# EAGLE design controller (EAGLE 7.2.0)
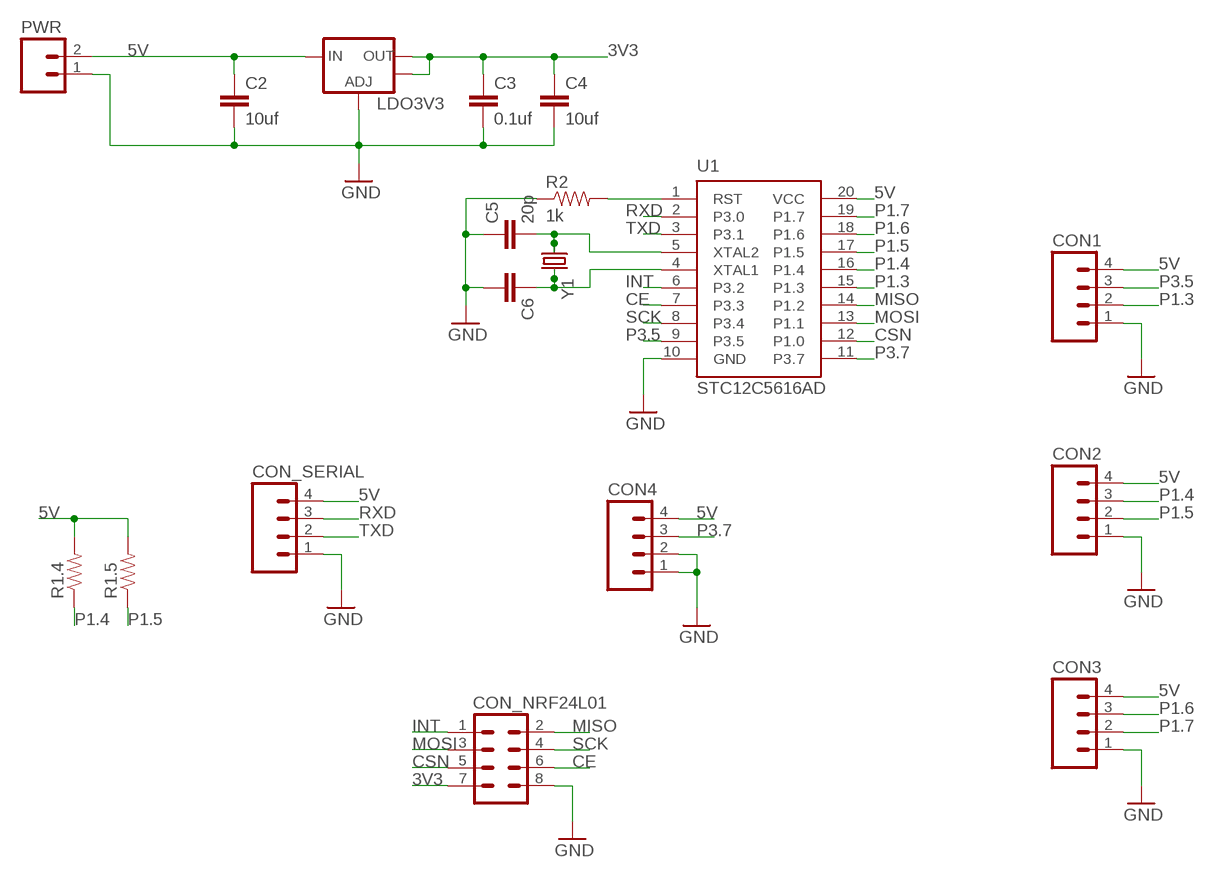
[diagram p0: schematic, sheet 1]

## Parts
C2  10uf  CAP0805  [0805]
C3  0.1uf  CAP0805  [0805]
C4  10uf  CAP0805  [0805]
C5  20p  CAP0603-CAP  [0603-CAP]
C6  CAP0603-CAP  [0603-CAP]
CON1  M04PTH  [1X04]
CON2  M04PTH  [1X04]
CON3  M04PTH  [1X04]
CON4  M04PTH  [1X04]
CON_NRF24L01  M04X2  [2X4]
CON_SERIAL  M04PTH  [1X04]
LDO3V3  V_REG_LM1117SOT223  [SOT223]
PWR  M02PTH  [1X02]
R1.4  RESISTOR0805-RES  [0805]
R1.5  RESISTOR0805-RES  [0805]
R2  1k  RESISTOR0805-RES  [0805]
U1  STC12C5616AD  [SOP20]
Y1  CRYSTALHC49US  [HC49US]

## Nets
3V3: C3.1 C4.1 CON_NRF24L01.7 LDO3V3.2(OUT) LDO3V3.4(OUT)
5V: C2.1 CON1.4 CON2.4 CON3.4 CON4.4 CON_SERIAL.4 LDO3V3.3(IN) PWR.2 R1.4.2 R1.5.2 U1.20(VCC)
CE: CON_NRF24L01.6 U1.7(P3.3)
CSN: CON_NRF24L01.5 U1.12(P1.0)
GND: C2.2 C3.2 C4.2 C5.1 C6.2 CON1.1 CON2.1 CON3.1 CON4.1 CON4.2 CON_NRF24L01.8 CON_SERIAL.1 LDO3V3.1(ADJ) PWR.1 R2.1 U1.10(GND)
INT: CON_NRF24L01.1 U1.6(P3.2)
MISO: CON_NRF24L01.2 U1.14(P1.2)
MOSI: CON_NRF24L01.3 U1.13(P1.1)
N$1: C5.2 U1.5(XTAL2) Y1.1
N$2: C6.1 U1.4(XTAL1) Y1.2
N$3: R2.2 U1.1(RST)
P1.3: CON1.2 U1.15(P1.3)
P1.4: CON2.3 R1.4.1 U1.16(P1.4)
P1.5: CON2.2 R1.5.1 U1.17(P1.5)
P1.6: CON3.3 U1.18(P1.6)
P1.7: CON3.2 U1.19(P1.7)
P3.5: CON1.3 U1.9(P3.5)
P3.7: CON4.3 U1.11(P3.7)
RXD: CON_SERIAL.3 U1.2(P3.0)
SCK: CON_NRF24L01.4 U1.8(P3.4)
TXD: CON_SERIAL.2 U1.3(P3.1)

## Library data of the parts
C2-C6 = SparkFun-Capacitors:CAP: Capacitor Standard 0603 ceramic capacitor, and 0.1" leaded capacitor.
CON1-CON4 CON_SERIAL = SparkFun-Connectors:M04: Header 4 Standard 4-pin 0.1" header. Use with straight break away headers (SKU : PRT-00116), right angle break away headers (PRT-00553), swiss pins (PRT-00743), machine pins (PRT-00117), and female headers (PRT-00115). Molex polarized connector foot print use with SKU : PRT-08231 with associated crimp pins and housings. 1MM SMD Version SKU: PRT-10208
CON_NRF24L01 = SparkFun-Connectors:M04X2: .1" header, two rows of four.
LDO3V3 = SparkFun-PowerIC:V_REG_LM1117: Voltage Regulator LM1117 Standard adjustable voltage regulator but in SMD form. Spark Fun Electronics SKU : COM-00595; PROD_ID: VREG-08170
PWR = SparkFun-Connectors:M02: Standard 2-pin 0.1" header. Use with - straight break away headers ( PRT-00116) - right angle break away headers (PRT-00553) - swiss pins (PRT-00743) - machine pins (PRT-00117) - female headers (PRT-00115) Molex polarized connector foot print use with: PRT-08233 with associated crimp pins and housings. 2.54_SCREWTERM for use with PRT-10571. 3.5mm Screw Terminal footprints for PRT-08084 5mm Screw Terminal footprints for use with PRT-08432
R1.4 R1.5 R2 = SparkFun-Resistors:RESISTOR: Resistor Basic schematic elements and footprints for 0603, 1206, and PTH resistors.
U1 = SparkFun-DigitalIC:STC12C5616AD
Y1 = SparkFun-FreqCtrl:CRYSTAL: Various standard crystals. Proven footprints.

## Board
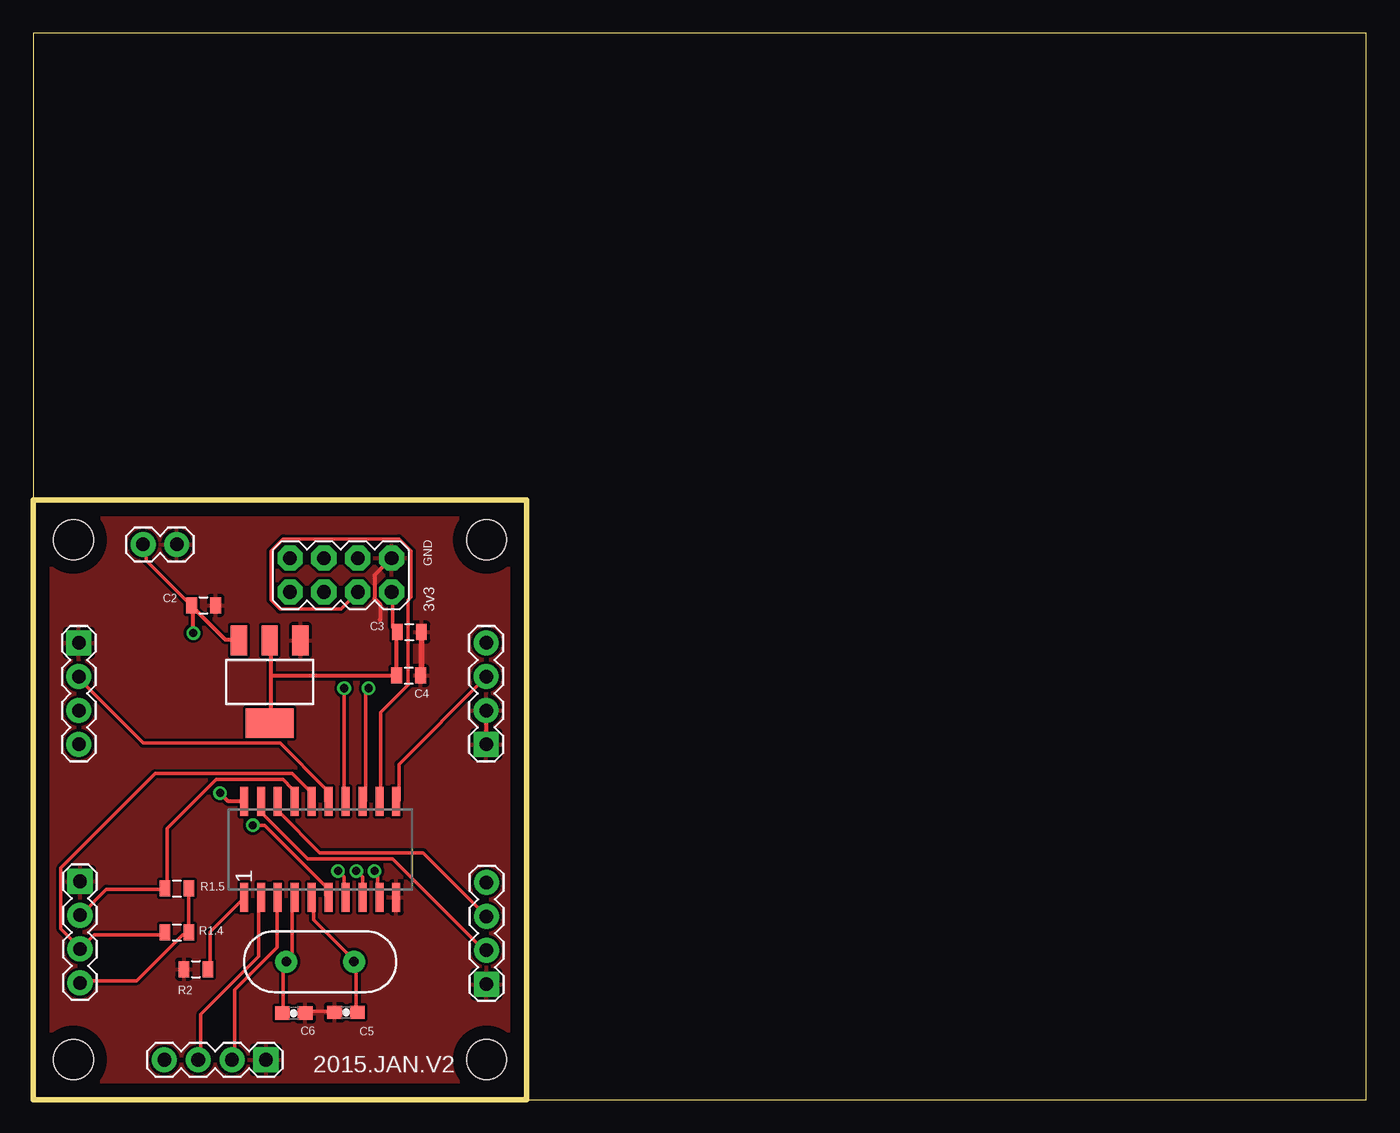
[diagram p1: board, top side]
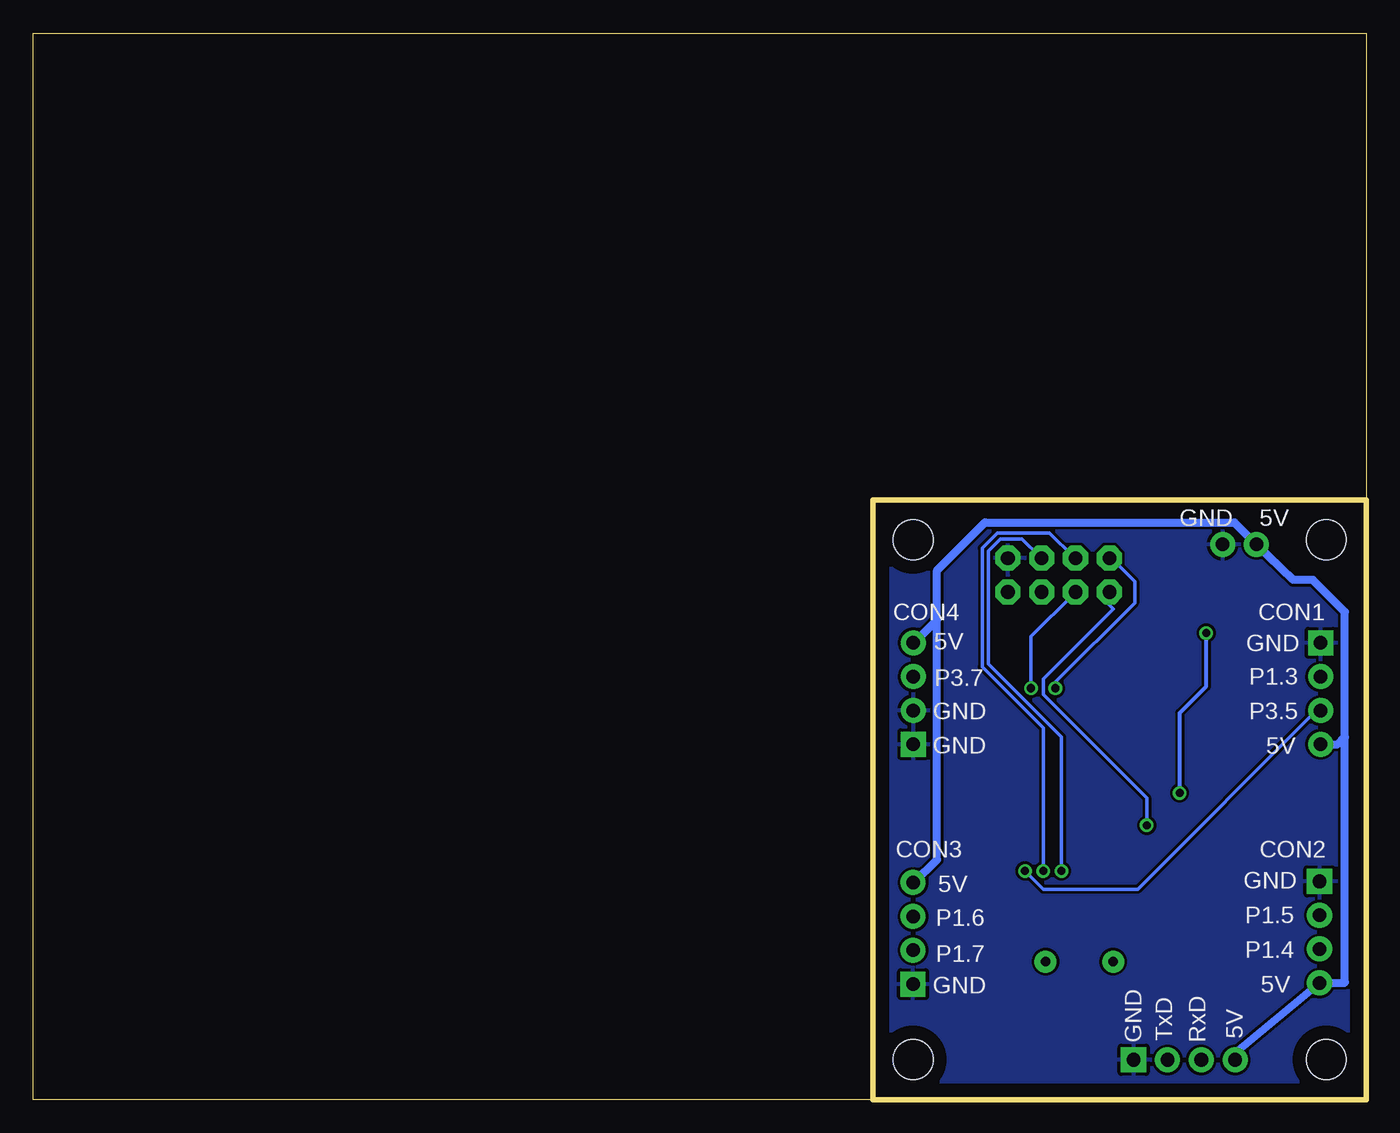
[diagram p2: board, bottom side, seen from below]

Size 100 x 80 mm. Coordinates in mm from the lower left corner, seen from the top.
Outline: 37,0 100,0 100,80 0,80 0,45
Outline: 0,45 0,0 35,0 37,0
Outline: 0,45 37,45 37,0
Copper layers (1*16): Top 0.035mm / dielectric 1.5mm / Bottom 0.035mm
Design rules "default": minimum track width 10mil, minimum drill 24mil, track to track 8mil, track to pad 8mil, pad to pad 8mil, via to via 8mil, smd to smd 8mil, copper to edge 40mil, drill to drill 8mil, minimum pad ring 10mil, minimum via ring 8mil, stop-mask expansion 4mil, vias tented up to drill 0mil, thermal gap 10mil
Holes 3 mm at 3,42 34,42 34,3 3,3

### Footprints (pad centres in the part's own frame; a part is rotated, then mirrored left to right if it is on the bottom)
0805 = smd 0.8 x 1.2: 1 -0.9,0; 2 0.9,0
0603-CAP = smd 1.1 x 1: 1 -0.85,0; 2 0.85,0
1X04 = drill 1.016 pad 1.88 square: 1 0,0 | drill 1.016 pad 1.88: 2 2.54,0; 3 5.08,0; 4 7.62,0
2X4 = drill 1.016 pad 1.88 octagon: 1 -3.81,-1.27; 2 -3.81,1.27; 3 -1.27,-1.27; 4 -1.27,1.27; 5 1.27,-1.27; 6 1.27,1.27; 7 3.81,-1.27; 8 3.81,1.27
SOT223 = smd 1.219 x 2.235: 1 -2.311,-3.099; 2 0,-3.099; 3 2.311,-3.099 | smd 3.6 x 2.2: 4 0,3.099
1X02 = drill 1.016 pad 1.88: 1 0,0; 2 2.54,0
SOP20 = smd 0.6 x 2.2: 1 -5.715,-3.6; 2 -4.445,-3.6; 3 -3.175,-3.6; 4 -1.905,-3.6; 5 -0.635,-3.6; 6 0.635,-3.6; 7 1.905,-3.6; 8 3.175,-3.6; 9 4.445,-3.6; 10 5.715,-3.6; 11 5.715,3.6; 12 4.445,3.6; 13 3.175,3.6; 14 1.905,3.6; 15 0.635,3.6; 16 -0.635,3.6; 17 -1.905,3.6; 18 -3.175,3.6; 19 -4.445,3.6; 20 -5.715,3.6
HC49US = drill 0.7 pad 1.651: 1 -2.54,0; 2 2.54,0

### Placement (x,y rotation side)
C2  12.78,37.08 0 top
C3  28.22,35.07 0 top
C4  28.16,31.81 0 top
C5  23.46,6.54 0 top
C6  19.54,6.48 0 top
CON1  3.42,34.27 270 top
CON2  3.5,16.37 270 top
CON3  34,8.66 90 top
CON4  33.98,26.65 90 top
CON_NRF24L01  23.07,39.35 0 top
CON_SERIAL  17.45,2.98 180 top
LDO3V3  17.73,31.34 180 top
PWR  10.77,41.65 180 top
R1.4  10.78,12.53 0 top
R1.5  10.78,15.84 0 top
R2  12.2,9.77 0 top
U1  21.52,18.77 0 top
Y1  21.52,10.34 180 top

### Tracks (layer width: path | path; a pad name or v marks a point on that pad's centre or on a via)
3V3
  Top 0.254: 27.2,32 C4.1 27.2,31.77 | 27.2,34.98 C3.1 27.2,35.2 26.98,35.43 26.98,37.95 CON_NRF24L01.7 | 17.83,34.29 LDO3V3.2 | 17.83,28.35 LDO3V3.4
  Top 0.305: 27.2,34.98 27.2,32 | 17.83,28.35 17.83,31.77 | 17.83,31.77 17.83,34.29 | 27.2,31.77 17.83,31.77
5V  (via drill 0.6)
  Top 0.254: 11.89,16 R1.5.2 11.66,15.77 11.66,12.57 R1.4.2 11.66,12.34 11.2,12.34 7.77,8.91 3.66,8.91 CON2.4 | 15.32,34.52 LDO3V3.3 | 11.89,37.03 C2.1 11.66,37.26 8.46,40.46 8.46,41.6 PWR.2
  Top 0.305: 15.32,34.52 14.4,34.52 11.89,37.03 | U1.20 14.63,22.37 v14,23 | v12,35 12,36.96 C2.1
  Bottom 0.254: 33.83,34.29 CON4.4
  Bottom 0.305: v14,23 14,29 12,31 v12,35
  Bottom 0.61: CON_SERIAL.4 9.83,3.52 CON2.4 1.65,8.75 1.6,8.8 1.6,27.2 | CON1.4 2.15,26.65 1.6,27.2 | 1.6,27.2 1.6,36.6 4,39 5.48,39 PWR.2 9.88,43.3 28.6,43.3 32.2,39.7 32.2,36 | CON3.4 33.92,16.28 32.2,18 32.2,36 | 33.83,34.29 33.83,34.37 32.2,36
CE  (via drill 0.61)
  Top 0.254: v22.86,17.14 23.32,16.69 23.32,15.32 U1.7
  Bottom 0.254: v22.86,17.14 22.86,27.2 28.35,32.69 28.35,41.15 27.43,42.06 25.83,42.06 24.46,40.69 CON_NRF24L01.6
CSN
  Top 0.254: U1.12 26.06,22.4 26.06,29.03 28.12,31.09 28.12,37.49 28.35,37.72 28.35,41.15 27.43,42.06 18.75,42.06 17.83,41.15 17.83,37.49 18.52,36.8 23.09,36.8 24.23,37.95 CON_NRF24L01.5
GND
  Top 0.254: C6.2 20.57,6.63 22.4,6.63 C5.1 | U1.10 27.2,15.32 27.23,15.32
  Top 0.305: CON4.2 CON4.1 | CON_NRF24L01.8 25.6,39.34 25.6,37.6 26,37.2 26,36
  Top 0.406: C4.2 29.12,31.81 C3.2
  pour Top: 0,45 0,0 37,0 37,45
  pour Bottom: 0,45 0,0 37,0 37,45
INT  (via drill 0.61)
  Top 0.254: U1.6 21.95,15.32 21.95,16 17.37,20.57 v16.46,20.57
  Bottom 0.254: v16.46,20.57 16.46,22.63 24.23,30.4 24.23,31.55 18.97,36.8 19.43,37.26 19.43,37.95 CON_NRF24L01.1
MISO  (via drill 0.61)
  Top 0.254: v23.32,30.86 23.32,22.4 U1.14
  Bottom 0.254: v23.32,30.86 23.32,31.32 17.37,37.26 17.37,38.86 19.2,40.69 CON_NRF24L01.2
MOSI  (via drill 0.61)
  Top 0.254: v25.15,30.86 24.92,30.63 24.92,22.4 U1.13
  Bottom 0.254: v25.15,30.86 25.15,34.75 21.95,37.95 CON_NRF24L01.3
N$1
  Top 0.254: C5.2 24.23,6.63 24.23,10.29 Y1.1 24,10.52 21.03,13.49 21.03,15.09 U1.5
N$2
  Top 0.254: C6.1 18.75,6.63 18.75,10.06 18.97,10.29 Y1.2 19.2,10.52 19.43,10.74 19.43,15.09 U1.4
N$3
  Top 0.254: R2.2 13.26,9.83 13.26,12.57 15.77,15.09 U1.1
P1.3
  Top 0.254: U1.15 21.95,22.4 21.95,23.32 18.52,26.75 8.23,26.75 3.43,31.55 CON1.2
P1.4
  Top 0.254: R1.4.1 9.83,12.34 4.57,12.34 3.66,11.43 CON2.3 3.43,11.43 2.06,12.8 2.06,17.37 9.14,24.46 19.43,24.46 20.8,23.09 20.8,22.4 U1.16
P1.5
  Top 0.254: CON2.2 3.66,13.95 5.49,15.77 9.83,15.77 R1.5.1 10.06,16 10.06,20.34 13.72,24 18.75,24 19.43,23.32 19.43,22.4 U1.17
P1.6
  Top 0.254: U1.18 18.52,22.17 18.52,21.49 21.49,18.52 29.26,18.52 33.83,13.95 CON3.3
P1.7
  Top 0.254: U1.19 17.14,22.17 17.14,21.49 20.57,18.06 26.98,18.06 33.83,11.2 CON3.2
P3.5  (via drill 0.61)
  Top 0.254: v25.6,17.14 25.83,16.92 25.83,15.32 U1.9
  Bottom 0.254: v25.6,17.14 24.23,15.77 17.14,15.77 3.89,29.03 3.43,29.03 CON1.3
P3.7
  Top 0.254: U1.11 27.43,22.4 27.43,25.15 33.83,31.55 CON4.3
RXD
  Top 0.254: U1.2 16.92,15.09 16.92,10.74 12.57,6.4 12.57,3.2 CON_SERIAL.3
SCK  (via drill 0.61)
  Top 0.254: v24.23,17.14 24.69,16.69 24.69,15.32 U1.8
  Bottom 0.254: v24.23,17.14 24.23,27.89 28.8,32.46 28.8,41.38 27.66,42.52 23.77,42.52 21.95,40.69 CON_NRF24L01.4
TXD
  Top 0.254: U1.3 18.29,15.09 18.29,11.43 15.09,8.23 15.09,3.2 CON_SERIAL.2

### Text on the board
tPlace: GND | 3v3 | 2015.JAN.V2
bPlace: 5V | GND | CON1 | CON4 | 5V | GND | P1.3 | P3.7 | P3.5 | GND | GND | 5V | CON2 | CON3 | 5V | GND | P1.5 | P1.6 | P1.4 | P1.7 | GND | 5V | RxD | TxD | GND | 5V